# Altium schematic sheet 18.SchDoc
size 513 x 386 mm
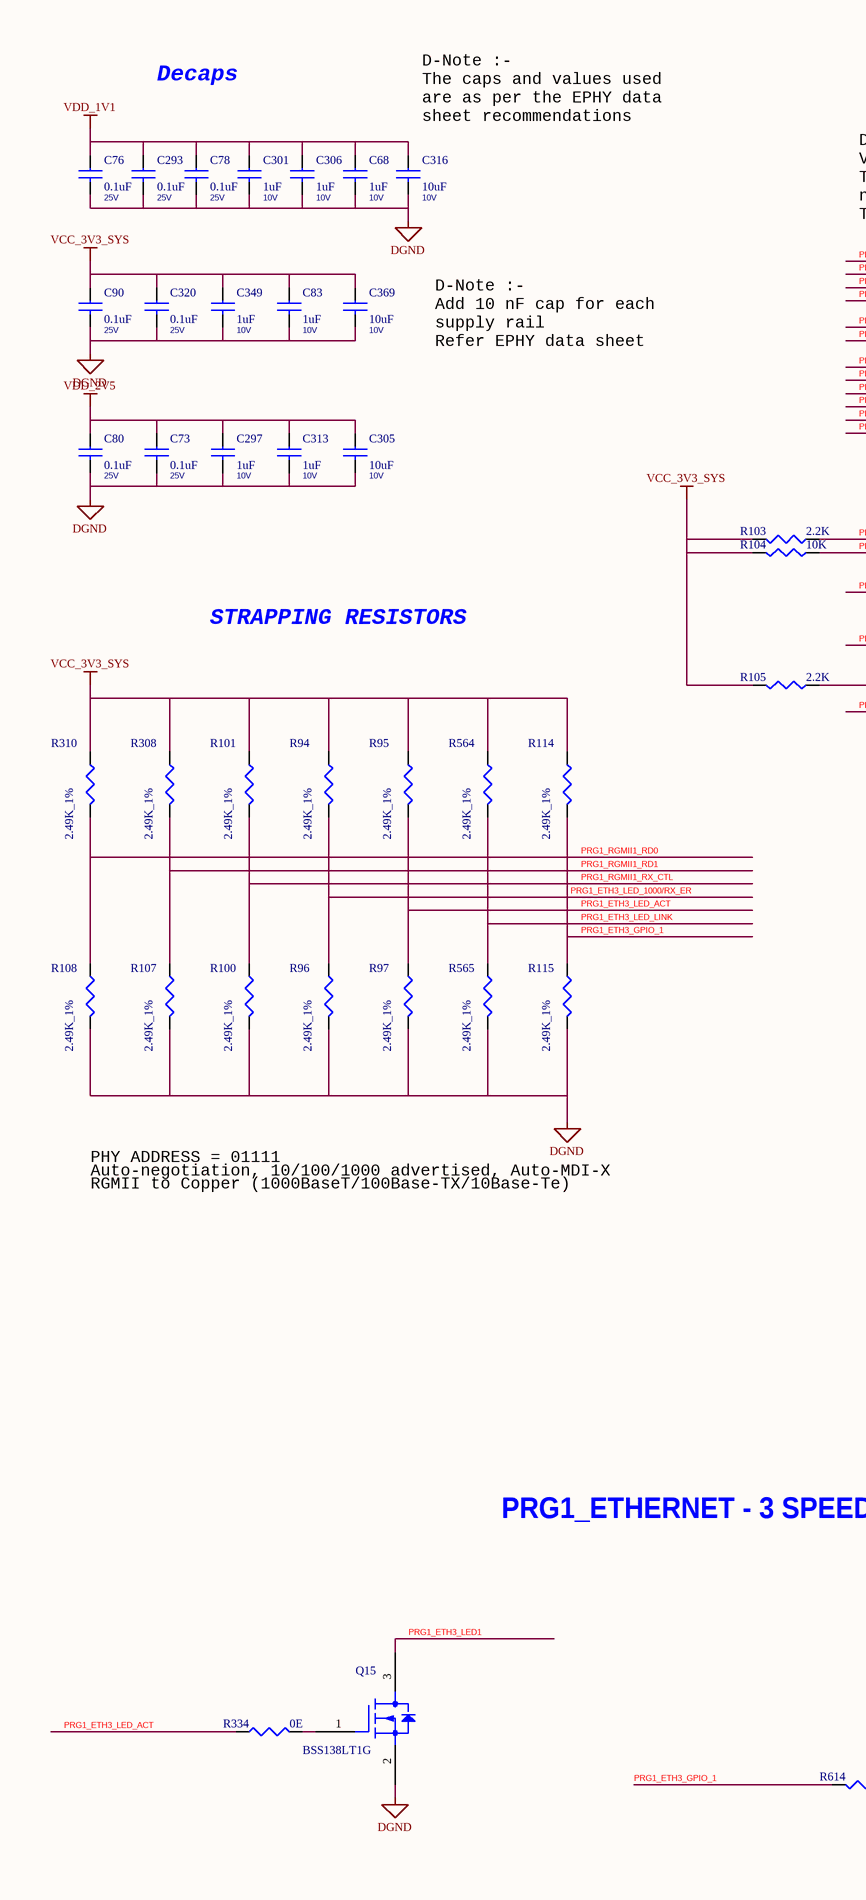
[diagram p0: 18.SchDoc, left]
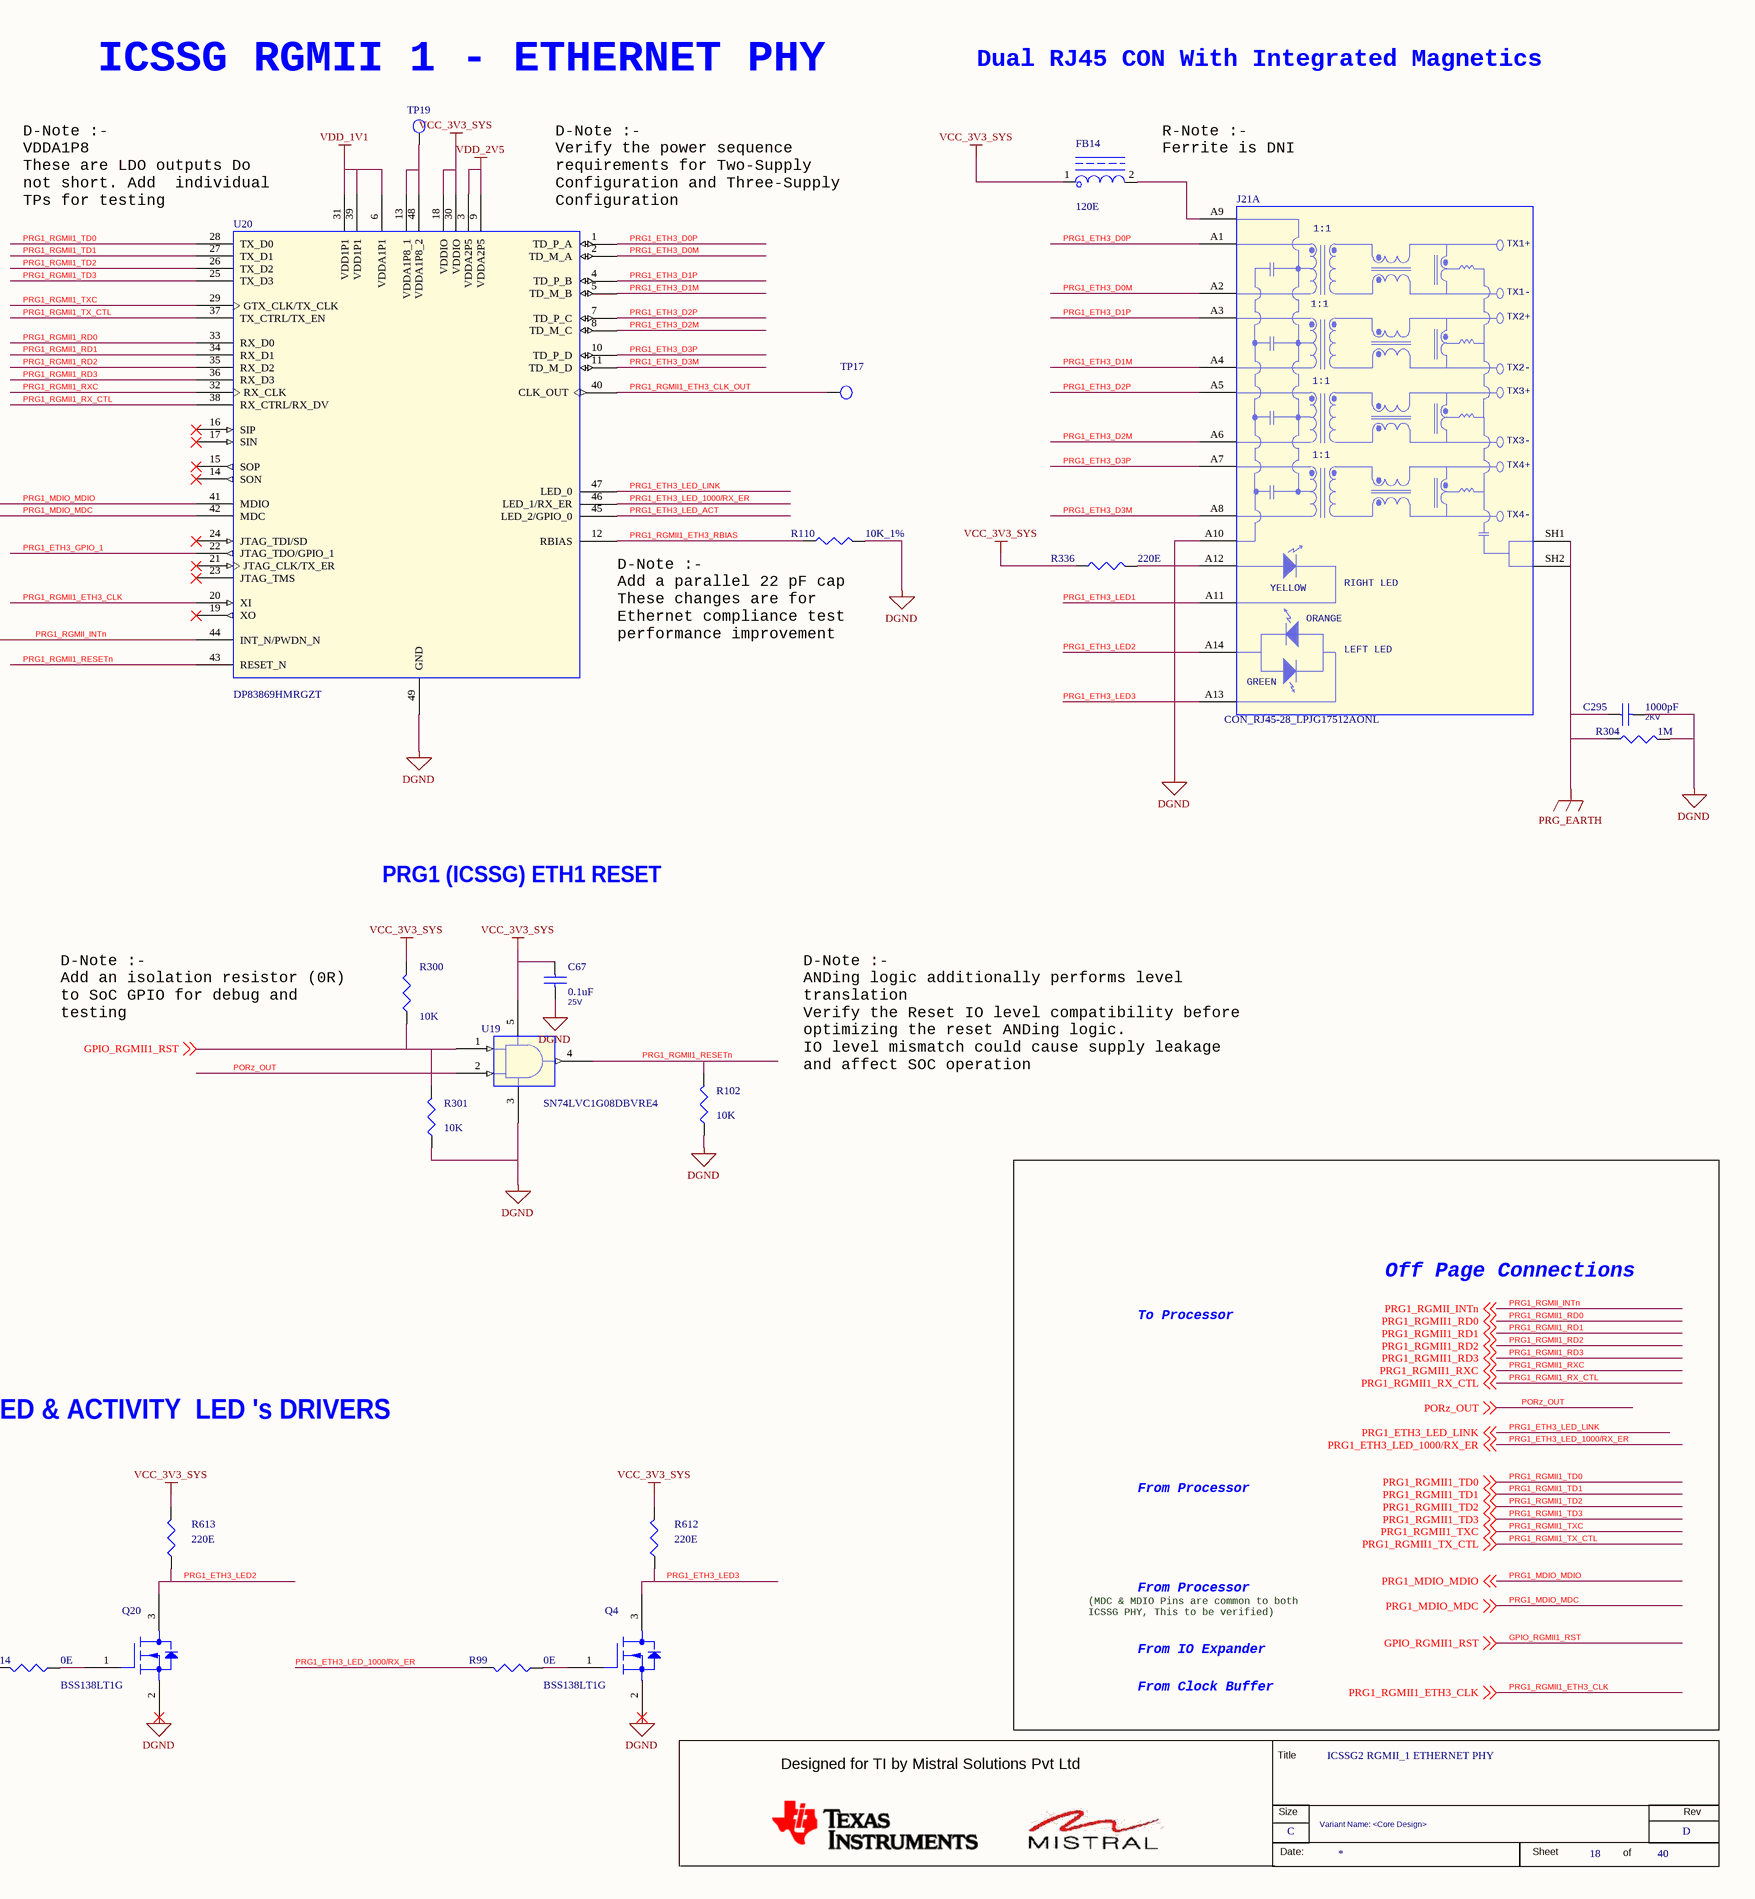
[diagram p1: 18.SchDoc, right]

## Parts
*  RevCode: D  Title: ICSSG2 RGMII_1 ETHERNET PHY  Page Size: C  Page Number: 18  Page Count: 40  Variant Name: <Core Design>  (hidden comment: MISTRAL_TITLEBLK_CSIZE)  (graphical)
C67  0.1uF  Voltage: 25V  [CAP0402_0-75]
C68  1uF  Voltage: 10V  [CAP0402_0-75]
C73  0.1uF  Voltage: 25V  [CAP0402_0-75]
C76  0.1uF  Voltage: 25V  [CAP0402_0-75]
C78  0.1uF  Voltage: 25V  [CAP0402_0-75]
C80  0.1uF  Voltage: 25V  [CAP0402_0-75]
C83  1uF  Voltage: 10V  [CAP0402_0-75]
C90  0.1uF  Voltage: 25V  [CAP0402_0-75]
C293  0.1uF  Voltage: 25V  [CAP0402_0-75]
C295  1000pF  Voltage: 2KV  [CAP1206_1-75]
C297  1uF  Voltage: 10V  [CAP0402_0-75]
C301  1uF  Voltage: 10V  [CAP0402_0-75]
C305  10uF  Voltage: 10V  [CAP0402_0-75]
C306  1uF  Voltage: 10V  [CAP0402_0-75]
C313  1uF  Voltage: 10V  [CAP0402_0-75]
C316  10uF  Voltage: 10V  [CAP0402_0-75]
C320  0.1uF  Voltage: 25V  [CAP0402_0-75]
C349  1uF  Voltage: 10V  [CAP0402_0-75]
C369  10uF  Voltage: 10V  [CAP0402_0-75]
FB14  120E  [IND0603_1]
J21  CON_RJ45-28_LPJG17512AONL  [CON_RJ45-28_LPJG17512_S_R_T_25-3]  (part A of 2)
Q4  BSS138LT1G  [SOT23-123_1-2]
Q15  BSS138LT1G  [SOT23-123_1-2]
Q20  BSS138LT1G  [SOT23-123_1-2]
R94  2.49K_1%  [RES0402_0-5]
R95  2.49K_1%  [RES0402_0-5]
R96  2.49K_1%  [RES0402_0-5]
R97  2.49K_1%  [RES0402_0-5]
R99  0E  [RES0402_0-5]
R100  2.49K_1%  [RES0402_0-5]
R101  2.49K_1%  [RES0402_0-5]
R102  10K  [RES0402_0-5]
R103  2.2K  [RES0402_0-5]
R104  10K  [RES0402_0-5]
R105  2.2K  [RES0402_0-5]
R107  2.49K_1%  [RES0402_0-5]
R108  2.49K_1%  [RES0402_0-5]
R110  10K_1%  [RES0402_0-5]
R114  2.49K_1%  [RES0402_0-5]
R115  2.49K_1%  [RES0402_0-5]
R300  10K  [RES0402_0-5]
R301  10K  [RES0402_0-5]
R304  1M  [RES0603_0-75]
R308  2.49K_1%  [RES0402_0-5]
R310  2.49K_1%  [RES0402_0-5]
R334  0E  [RES0402_0-5]
R336  220E  [RES0402_0-5]
R564  2.49K_1%  [RES0402_0-5]
R565  2.49K_1%  [RES0402_0-5]
R612  220E  [RES0402_0-5]
R613  220E  [RES0402_0-5]
R614  0E  [RES0402_0-5]
TP17  TP20_SMD  [TP20_SMD]  (value not drawn)
TP19  TP20_SMD  [TP20_SMD]  (value not drawn)
U19  SN74LVC1G08DBVRE4  [SOT23-5]
U20  DP83869HMRGZT  [QFN48_19-68_280X280_1_EP4-2]

## Nets
DGND: C67.2 C68.2 C73.2 C76.2 C78.2 C80.2 C83.2 C90.2 C293.2 C295.2 C297.2 C301.2 C305.2 C306.2 C313.2 C316.2 C320.2 C349.2 C369.2 J21.A10(GND) Q4.2(S) Q15.2(S) Q20.2(S) R96.2 R97.2 R100.2 R102.2 R107.2 R108.2 R110.1 R115.2 R301.2 R304.2 R565.2 U19.3(GND) U20.49(GND)
PRG_EARTH: C295.1 J21.SH1 J21.SH2 R304.1
VCC_3V3_SYS: C67.1 C83.1 C90.1 C320.1 C349.1 C369.1 FB14.1 R94.1 R95.1 R101.1 R103.2 R104.1 R105.2 R114.1 R300.2 R308.1 R310.1 R336.1 R564.1 R612.2 R613.2 U19.5(VCC) U20.18(VDDIO) U20.30(VDDIO)
VDD_1V1: C68.1 C76.1 C78.1 C293.1 C301.1 C306.1 C316.1 U20.6(VDDA1P1) U20.31(VDD1P1) U20.39(VDD1P1)
VDD_2V5: C73.1 C80.1 C297.1 C305.1 C313.1 U20.3(VDDA2P5) U20.9(VDDA2P5)
GPIO_RGMII1_RST: R300.1 R301.1 U19.1(A) ; off-sheet GPIO_RGMII1_RST
PORz_OUT: U19.2(B) ; off-sheet PORz_OUT
PRG1_ETH3_D0M: J21.A2(TD1-_1) U20.2(TD_M_A)
PRG1_ETH3_D0P: J21.A1(TD1+_1) U20.1(TD_P_A)
PRG1_ETH3_D1M: J21.A4(TD2-_1) U20.5(TD_M_B)
PRG1_ETH3_D1P: J21.A3(TD2+_1) U20.4(TD_P_B)
PRG1_ETH3_D2M: J21.A6(TD3-_1) U20.8(TD_M_C)
PRG1_ETH3_D2P: J21.A5(TD3+_1) U20.7(TD_P_C)
PRG1_ETH3_D3M: J21.A8(TD4-_1) U20.11(TD_M_D)
PRG1_ETH3_D3P: J21.A7(TD4+_1) U20.10(TD_P_D)
PRG1_ETH3_GPIO_1: R114.2 R115.1 R614.2 U20.22(JTAG_TDO/GPIO_1)
PRG1_ETH3_LED1: J21.A11 Q15.3(D)
PRG1_ETH3_LED2: J21.A14 Q20.3(D) R613.1
PRG1_ETH3_LED3: J21.A13 Q4.3(D) R612.1
PRG1_ETH3_LED_1000/RX_ER: R94.2 R96.1 R99.2 U20.46(LED_1/RX_ER) ; off-sheet PRG1_ETH3_LED_1000/RX_ER
PRG1_ETH3_LED_ACT: R95.2 R97.1 R334.1 U20.45(LED_2/GPIO_0)
PRG1_ETH3_LED_LINK: R564.2 R565.1 U20.47(LED_0) ; off-sheet PRG1_ETH3_LED_LINK
PRG1_MDIO_MDC: R104.2 U20.42(MDC) ; off-sheet PRG1_MDIO_MDC
PRG1_MDIO_MDIO: R103.1 U20.41(MDIO) ; off-sheet PRG1_MDIO_MDIO
PRG1_RGMII1_ETH3_CLK: U20.20(XI) ; off-sheet PRG1_RGMII1_ETH3_CLK
PRG1_RGMII1_ETH3_CLK_OUT: TP17.1(TP) U20.40(CLK_OUT)
PRG1_RGMII1_ETH3_RBIAS: R110.2 U20.12(RBIAS)
PRG1_RGMII1_RD0: R108.1 R310.2 U20.33(RX_D0) ; off-sheet PRG1_RGMII1_RD0
PRG1_RGMII1_RD1: R107.1 R308.2 U20.34(RX_D1) ; off-sheet PRG1_RGMII1_RD1
PRG1_RGMII1_RD2: U20.35(RX_D2) ; off-sheet PRG1_RGMII1_RD2
PRG1_RGMII1_RD3: U20.36(RX_D3) ; off-sheet PRG1_RGMII1_RD3
PRG1_RGMII1_RESETn: R102.1 U19.4(Y) U20.43(RESET_N)
PRG1_RGMII1_RX_CTL: R100.1 R101.2 U20.38(RX_CTRL/RX_DV) ; off-sheet PRG1_RGMII1_RX_CTL
PRG1_RGMII1_RXC: U20.32(RX_CLK) ; off-sheet PRG1_RGMII1_RXC
PRG1_RGMII1_TD0: U20.28(TX_D0) ; off-sheet PRG1_RGMII1_TD0
PRG1_RGMII1_TD1: U20.27(TX_D1) ; off-sheet PRG1_RGMII1_TD1
PRG1_RGMII1_TD2: U20.26(TX_D2) ; off-sheet PRG1_RGMII1_TD2
PRG1_RGMII1_TD3: U20.25(TX_D3) ; off-sheet PRG1_RGMII1_TD3
PRG1_RGMII1_TX_CTL: U20.37(TX_CTRL/TX_EN) ; off-sheet PRG1_RGMII1_TX_CTL
PRG1_RGMII1_TXC: U20.29(GTX_CLK/TX_CLK) ; off-sheet PRG1_RGMII1_TXC
PRG1_RGMII_INTn: R105.1 U20.44(INT_N/PWDN_N) ; off-sheet PRG1_RGMII_INTn
NetFB14_2: FB14.2 J21.A9(VCC)
NetJ21_A12: J21.A12 R336.2
NetQ4_1: Q4.1(G) R99.1
NetQ15_1: Q15.1(G) R334.2
NetQ20_1: Q20.1(G) R614.1
NetTP19_1: TP19.1(TP) U20.13(VDDA1P8_1) U20.48(VDDA1P8_2)

Not connected (* = marked no-connect by the designer): U20 14(SON)* 15(SOP)* 16(SIP)* 17(SIN)* 19(XO)* 21(JTAG_CLK/TX_ER)* 23(JTAG_TMS)* 24(JTAG_TDI/SD)*

## Notes on the sheet
- (near C316) D-Note :-
  The caps and values used
  are as per the EPHY data
  sheet recommendations
- Decaps
- ICSSG RGMII 1 - ETHERNET PHY
- Dual RJ45 CON With Integrated Magnetics
- (near U20) D-Note :-
  VDDA1P8
  These are LDO outputs Do
  not short. Add  individual
  TPs for testing
- (near U20) D-Note :-
  Verify the power sequence
  requirements for Two-Supply
  Configuration and Three-Supply
  Configuration
- R-Note :-
  Ferrite is DNI
- D-Note :-
  Add 10 nF cap for each
  supply rail
  Refer EPHY data sheet
- STRAPPING RESISTORS
- (near R110) D-Note :-
  Add a parallel 22 pF cap
  These changes are for
  Ethernet compliance test
  performance improvement
- PRG1 (ICSSG) ETH1 RESET
- (near R300) D-Note :-
  Add an isolation resistor (0R)
  to SoC GPIO for debug and
  testing
- D-Note :-
  ANDing logic additionally performs level
  translation
  Verify the Reset IO level compatibility before
  optimizing the reset ANDing logic.
  IO level mismatch could cause supply leakage
  and affect SOC operation
- PHY ADDRESS = 01111
- Auto-negotiation, 10/100/1000 advertised, Auto-MDI-X
- RGMII to Copper (1000BaseT/100Base-TX/10Base-Te)
- Off Page Connections
- To Processor
- PRG1_ETHERNET - 3 SPEED & ACTIVITY  LED 's DRIVERS
- From Processor
- (MDC & MDIO Pins are common to both
  ICSSG PHY, This to be verified)
- From IO Expander
- From Clock Buffer
- (in symbol CON_RJ45-28_LPJG17512AONL, part A) 1:1; TX1+; TX1-; TX2+; TX2-; TX3+; TX3-; TX4+; TX4-; RIGHT LED; YELLOW; ORANGE; LEFT LED; GREEN
- (in symbol MISTRAL_TITLEBLK_CSIZE) Title; Designed for TI by Mistral Solutions Pvt Ltd; Size; Rev; Date:; Sheet; of

## Library data of the parts
* = MISTRAL_TITLEBLK_CSIZE: Issue: 1.0; Page Create Date: March  8, 1995; Page Modify Date: *
C67 C73 C76 C78 C80 C90 C293 C320 = CAP_Dup3: CAP CERAMIC 0.1uF 25V 20% X5R 0402; Alt_Mfr_name: YAGEO AMERICA; Part_type: CAPACITORS\CERAMIC; Mfr_part_number: 885012105018; Mfr_name: WURTH ELECTRONICS; Mistral Part No: 120020080003-R; Alt_Mfr_part_number: CC0402KRX5R8BB104; Custom_Duty: 15%; Customs_HS_Code: 85322990; Wattage: NA; Project: AM64x_EVM_BRD; Footprint Path: Y:\MIS_DATABASE\Library\ALTIUM_TOOL\PCB_FOOTPRINTS\Altium_Footprint_Lib.PcbLib; Library Path: Y:\MIS_DATABASE\Library\ALTIUM_TOOL\SCHEMATICS_PARTS\MS_DISCRETE_Library.schlib; Footprint Ref: CAP0402_0-75; Library Ref: CAP; MECHANICAL 3D STEP FILE: CAP0402_0-75; Chkd/date: MANIRAJA/170820; Crtd /date: ALVY/170820; Datasheet: Y:\MIS_DATABASE\DATASHEETS\CAPACITORS\885012105018.PDF; Temperature: -55癈+85癈; Weight: 0.65mg; Height: 0.55MM; Distributor_part_number: 732-7495-1-ND; Distributor_name: DIGIKEY; Package: 0402; Tolerance: 20%; PCB Footprint: CAP0402_0-75
C68 C297 C301 C313 C349 = CAP_Dup3: CAP CERAMIC 1uF 10V 20% X5R 0402; Part_type: CAPACITORS\CERAMIC; Mfr_part_number: 885012105012; Mfr_name: WURTH ELECTRONICS; Mistral Part No: 120020080009-R; Custom_Duty: 15%; Customs_HS_Code: 85322990; Wattage: NA; Project: AM64x_EVM_BRD; Footprint Ref: CAP0402_0-75; Library Ref: CAP; Chkd/date: MANIRAJA/210820; Crtd /date: ALVY/190820; Datasheet: Y:\MIS_DATABASE\DATASHEETS\CAPACITORS\885012105012.PDF; Temperature: -55癈+85癈; Weight: 0.65mg; Height: 0.55MM; Distributor_part_number: 732-7489-1-ND; Distributor_name: DIGIKEY; Package: 0402; Tolerance: 20%; MECHANICAL 3D STEP FILE: CAP0402_0-75; Library Path: Y:\MIS_DATABASE\Library\ALTIUM_TOOL\SCHEMATICS_PARTS\MS_DISCRETE_Library.schlib; Footprint Path: Y:\MIS_DATABASE\Library\ALTIUM_TOOL\PCB_FOOTPRINTS\Altium_Footprint_Lib.PcbLib; PCB Footprint: CAP0402_0-75
C83 C306 = CAP_Dup3: CAP CERAMIC 1uF 10V 20% X5R 0402; Mistral Part No: 120020080009-R; Mfr_name: WURTH ELECTRONICS; Mfr_part_number: 885012105012; Part_type: CAPACITORS\CERAMIC; Project: AM64x_EVM_BRD; Wattage: NA; Customs_HS_Code: 85322990; Custom_Duty: 15%; Footprint Path: Y:\MIS_DATABASE\Library\ALTIUM_TOOL\PCB_FOOTPRINTS\Altium_Footprint_Lib.PcbLib; Library Path: Y:\MIS_DATABASE\Library\ALTIUM_TOOL\SCHEMATICS_PARTS\MS_DISCRETE_Library.schlib; MECHANICAL 3D STEP FILE: CAP0402_0-75; Tolerance: 20%; Package: 0402; Distributor_name: DIGIKEY; Distributor_part_number: 732-7489-1-ND; Height: 0.55MM; Weight: 0.65mg; Temperature: -55癈+85癈; Datasheet: Y:\MIS_DATABASE\DATASHEETS\CAPACITORS\885012105012.PDF; Crtd /date: ALVY/190820; Chkd/date: MANIRAJA/210820; Library Ref: CAP; Footprint Ref: CAP0402_0-75; PCB Footprint: CAP0402_0-75
C295 = CAP_Dup3: CAP CERAMIC 1000pF 2KV 10% X7R 1206; Mistral Part No: 120015080006-R; Mfr_name: AVX CORPORATION; Mfr_part_number: 1206GC102KAT1A; Part_type: CAPACITORS\CERAMIC; Project: ADR1B; Customs_HS_Code: 85322990; Custom_Duty: 15%; Wattage: NA; Tolerance: 10%; Package: 1206; Distributor_name: DIGIKEY; Distributor_part_number: 478-2956-1-ND; Height: 1.52MM; Weight: 16.2mg; Temperature: -55癈+125癈; Datasheet: Y:\MIS_DATABASE\DATASHEETS\CAPACITORS\AVX_HV-MLC.PDF; Crtd /date: MAZHAR/281106; Chkd/date: SHREESHAIL/291106; Library Ref: CAP; Footprint Ref: CAP1206_1-75; Library Path: Y:\MIS_DATABASE\Library\ALTIUM_TOOL\SCHEMATICS_PARTS\MS_DISCRETE_Library.schlib; Footprint Path: Y:\MIS_DATABASE\Library\ALTIUM_TOOL\PCB_FOOTPRINTS\Altium_Footprint_Lib.PcbLib; MECHANICAL 3D STEP FILE: CAP1206_1-75; PCB Footprint: CAP1206_1-75
C305 = CAP_Dup3: CAP CERAMIC 10uF 10V 20% X5R 0402; Part_type: CAPACITORS\CERAMIC; Mfr_part_number: GRM155R61A106ME11D; Mfr_name: MURATA; Mistral Part No: 120013110019-R; Custom_Duty: 15%; Customs_HS_Code: 85322990; Project: QCS610_NANOSOM; Wattage: NA; Footprint Path: Y:\MIS_DATABASE\Library\ALTIUM_TOOL\PCB_FOOTPRINTS\Altium_Footprint_Lib.PcbLib; Library Path: Y:\MIS_DATABASE\Library\ALTIUM_TOOL\SCHEMATICS_PARTS\MS_DISCRETE_Library.schlib; Footprint Ref: CAP0402_0-75; Chkd/date: MANIRAJA/300520; Crtd /date: ALVY/260520; Datasheet: Y:\MIS_DATABASE\DATASHEETS\CAPACITORS\MURATA-GXX-SER_NOV17.PDF; Height: 0.55MM; Distributor_part_number: 490-GRM155R61A106ME11DTR-ND; Distributor_name: DIGIKEY; Package: 0402; Tolerance: 20%; Weight: 3.1mg; Temperature: -55癈+85癈; MECHANICAL 3D STEP FILE: CAP0402_0-75; Library Ref: CAP; PCB Footprint: CAP0402_0-75
C316 = CAP_Dup3: CAP CERAMIC 10uF 10V 20% X5R 0402; Mistral Part No: 120013110019-R; Mfr_name: MURATA; Mfr_part_number: GRM155R61A106ME11D; Part_type: CAPACITORS\CERAMIC; Wattage: NA; Project: QCS610_NANOSOM; Customs_HS_Code: 85322990; Custom_Duty: 15%; Footprint Path: Y:\MIS_DATABASE\Library\ALTIUM_TOOL\PCB_FOOTPRINTS\Altium_Footprint_Lib.PcbLib; Library Path: Y:\MIS_DATABASE\Library\ALTIUM_TOOL\SCHEMATICS_PARTS\MS_DISCRETE_Library.schlib; Footprint Ref: CAP0402_0-75; Library Ref: CAP; MECHANICAL 3D STEP FILE: CAP0402_0-75; Temperature: -55癈+85癈; Weight: 3.1mg; Tolerance: 20%; Package: 0402; Distributor_name: DIGIKEY; Distributor_part_number: 490-GRM155R61A106ME11DTR-ND; Height: 0.55MM; Datasheet: Y:\MIS_DATABASE\DATASHEETS\CAPACITORS\MURATA-GXX-SER_NOV17.PDF; Crtd /date: ALVY/260520; Chkd/date: MANIRAJA/300520; PCB Footprint: CAP0402_0-75
C369 = CAP_Dup3: CAP CERAMIC 10uF 10V 20% X5R 0402; Part_type: CAPACITORS\CERAMIC; Mfr_part_number: GRM155R61A106ME11D; Mfr_name: MURATA; Mistral Part No: 120013110019-R; Wattage: NA; Custom_Duty: 15%; Customs_HS_Code: 85322990; Project: QCS610_NANOSOM; Footprint Path: Y:\MIS_DATABASE\Library\ALTIUM_TOOL\PCB_FOOTPRINTS\Altium_Footprint_Lib.PcbLib; Library Path: Y:\MIS_DATABASE\Library\ALTIUM_TOOL\SCHEMATICS_PARTS\MS_DISCRETE_Library.schlib; Footprint Ref: CAP0402_0-75; Library Ref: CAP; MECHANICAL 3D STEP FILE: CAP0402_0-75; Temperature: -55癈+85癈; Weight: 3.1mg; Chkd/date: MANIRAJA/300520; Crtd /date: ALVY/260520; Datasheet: Y:\MIS_DATABASE\DATASHEETS\CAPACITORS\MURATA-GXX-SER_NOV17.PDF; Height: 0.55MM; Distributor_part_number: 490-GRM155R61A106ME11DTR-ND; Distributor_name: DIGIKEY; Package: 0402; Tolerance: 20%; PCB Footprint: CAP0402_0-75
FB14 = INDUCTOR_FERRITE: IND FERRITE BEAD CHIP 120E 2A 0603; Mistral Part No: 130020080015-R; Mfr_name: WURTH ELECTRONICS; Mfr_part_number: 782631141; Project: AM64x_EVM_BRD; Tolerance: 25%; Voltage: NA; Customs_HS_Code: 85437099; Custom_Duty: 24%; PCB Footprint: IND0603_1; Footprint Ref: IND0603_1; Part_type: INDUCTOR; Wattage: NA; Package: 0603; Distributor_name: DIGIKEY; Distributor_part_number: 732-782631141CT-ND; Library Ref: INDUCTOR_FERRITE; Height: 1.00MM; Weight: NA; Temperature: -55癈+125癈; Datasheet: Y:\MIS_DATABASE\DATASHEETS\DISCRETES\INDUCTORS\782631141.PDF; Crtd /date: ALVY/180820; Chkd/date: MANIRAJA/180820; MECHANICAL 3D STEP FILE: IND0603_1; Library Path: Y:\MIS_DATABASE\Library\ALTIUM_TOOL\SCHEMATICS_PARTS\MS_FILTER_Library.schlib; Footprint Path: Y:\MIS_DATABASE\Library\ALTIUM_TOOL\PCB_FOOTPRINTS\Altium_Footprint_Lib.PcbLib
J21 = CON_RJ45-28_LPJG17512AONL: CON JACK RJ45 28POS REGISTERED FEMALE RA TH; Mistral Part No: 150017080001-R; Mfr_name: LINK-PP; Part_type: CONNECTOR\JACK; Project: TI_SVB_DUT; Tolerance: NA; Customs_HS_Code: 85369090; Custom_Duty: 24%; Mfr_part_number: LPJG17512AONL; Voltage: NA; Wattage: NA; Package: THRU-HOLE; Distributor_name: NA; Distributor_part_number: NA; Height: 25.30MM; Weight: NA; Temperature: 0癈+70癈; Datasheet: Y:\MIS_DATABASE\DATASHEETS\CONNECTORS\LPJG17512AONL.PDF; Crtd /date: MANIRAJA/010817; Chkd/date: MANIRAJA/010817; MECHANICAL 3D STEP FILE: CON_RJ45-28_LPJG17512_S_R_T_25-3; Library Ref: CON_RJ45-28_LPJG17512AONL; PCB Footprint: CON_RJ45-28_LPJG17512_S_R_T_25-3
Q4 Q15 Q20 = MOSFET_BSS138LT1G: IC MOSFET N-CHANNEL 50V 200mA SOT23-3; Mistral Part No: 142016040001-R; Mfr_name: ON SEMICONDUCTOR; Part_type: ICS\POWER\MOSFET; Project: LRDE_ABCM; Tolerance: NA; Customs_HS_Code: 85423100; Custom_Duty: 15%; Footprint Path: Y:\MIS_DATABASE\Library\ALTIUM_TOOL\PCB_FOOTPRINTS\Altium_Footprint_Lib.PcbLib; Library Path: Y:\MIS_DATABASE\Library\ALTIUM_TOOL\SCHEMATICS_PARTS\MS_MOSFET_Library.schlib; MECHANICAL 3D STEP FILE: SOT23-123_1-2; Footprint Ref: SOT23-123_1-2; Mfr_part_number: BSS138LT1G; Voltage: NA; Wattage: NA; Package: SOT23-3; Distributor_name: DIGIKEY; Distributor_part_number: BSS138LT1GOSCT-ND; Height: 1.11MM; Weight: 8mg; Temperature: -55癈+150癈; Datasheet: Y:\MIS_DATABASE\DATASHEETS\DISCRETES\TRANSISTORS_FETS\BSS138LT1G.PDF; Crtd /date: JEBRAN/060416; Chkd/date: MANIRAJA/250219; Library Ref: MOSFET_BSS138W; PCB Footprint: SOT23-123_1-2
R94 R97 R115 R308 R310 R564 R565 = RESISTOR_Dup6: RES 2.49K 1/16W 1% 0402; Mistral Part No: 110016050020-R; Mfr_name: YAGEO AMERICA; Mfr_part_number: RC0402FR-072K49L; Part_type: RESISTORS\FIXED; Project: TMDXCSKCC; Voltage: NA; Customs_HS_Code: 85332119; Custom_Duty: 15%; Tolerance: 1%; Wattage: 1/16W; Package: 0402; Distributor_name: DIGIKEY; Distributor_part_number: 311-2.49KLRCT-ND; Height: 0.40MM; Weight: 0.65mg; Temperature: -55癈+155癈; Datasheet: Y:\MIS_DATABASE\DATASHEETS\RESISTORS\RCXXXXL-SER_MAR18.PDF; Crtd /date: VASANTHA/270516; Chkd/date: VASANTHA/270516; Library Ref: RESISTOR; Footprint Ref: RES0402_0-5; MECHANICAL 3D STEP FILE: RES0402_0-5; Library Path: Y:\MIS_DATABASE\Library\ALTIUM_TOOL\SCHEMATICS_PARTS\MS_DISCRETE_Library.schlib; Footprint Path: Y:\MIS_DATABASE\Library\ALTIUM_TOOL\PCB_FOOTPRINTS\Altium_Footprint_Lib.PcbLib; PCB Footprint: RES0402_0-5
R95 R96 R100 R101 R107 R108 R114 = RESISTOR_Dup6: RES 2.49K 1/16W 1% 0402; Part_type: RESISTORS\FIXED; Mfr_part_number: RC0402FR-072K49L; Mfr_name: YAGEO AMERICA; Mistral Part No: 110016050020-R; Custom_Duty: 15%; Customs_HS_Code: 85332119; Voltage: NA; Project: TMDXCSKCC; Library Ref: RESISTOR; Chkd/date: VASANTHA/270516; Crtd /date: VASANTHA/270516; Datasheet: Y:\MIS_DATABASE\DATASHEETS\RESISTORS\RCXXXXL-SER_MAR18.PDF; Temperature: -55癈+155癈; Weight: 0.65mg; Height: 0.40MM; Distributor_part_number: 311-2.49KLRCT-ND; Distributor_name: DIGIKEY; Package: 0402; Wattage: 1/16W; Tolerance: 1%; Footprint Ref: RES0402_0-5; MECHANICAL 3D STEP FILE: RES0402_0-5; Library Path: Y:\MIS_DATABASE\Library\ALTIUM_TOOL\SCHEMATICS_PARTS\MS_DISCRETE_Library.schlib; Footprint Path: Y:\MIS_DATABASE\Library\ALTIUM_TOOL\PCB_FOOTPRINTS\Altium_Footprint_Lib.PcbLib; PCB Footprint: RES0402_0-5
R99 R614 = RESISTOR_Dup5: RES 0E 1/16W JUMPER 0402; Mistral Part No: 110010080019-R; Mfr_name: VISHAY; Mfr_part_number: CRCW04020000Z0ED; Part_type: RESISTORS\FIXED; Project: PB_BUGBASE; Tolerance: NA; Customs_HS_Code: 85332119; Custom_Duty: 15%; Voltage: NA; Wattage: 1/16W; Package: 0402; Distributor_name: DIGIKEY; Distributor_part_number: 541-0.0JCT-ND; Height: 0.40MM; Weight: 0.65mg; Temperature: -55癈+155癈; Datasheet: Y:\MIS_DATABASE\DATASHEETS\RESISTORS\CRCW0603.PDF; Crtd /date: MUDDU/190810; Chkd/date: VASANTHA/201216; MECHANICAL 3D STEP FILE: RES0402_0-5; Library Ref: RESISTOR; Footprint Ref: RES0402_0-5; Library Path: Y:\MIS_DATABASE\Library\ALTIUM_TOOL\SCHEMATICS_PARTS\MS_DISCRETE_Library.schlib; Footprint Path: Y:\MIS_DATABASE\Library\ALTIUM_TOOL\PCB_FOOTPRINTS\Altium_Footprint_Lib.PcbLib; PCB Footprint: RES0402_0-5
R102 R104 R300 = RESISTOR_Dup6: RES 10K 1/16W 5% 0402; Mistral Part No: 110011060021-R; Mfr_name: YAGEO AMERICA; Mfr_part_number: RC0402JR-0710KL; Part_type: RESISTORS\FIXED; Project: HSE; Voltage: NA; Customs_HS_Code: 85332119; Custom_Duty: 15%; Tolerance: 5%; Wattage: 1/16W; Package: 0402; Distributor_name: DIGIKEY; Distributor_part_number: 311-10KJRCT-ND; Height: 0.40MM; Weight: 0.65mg; Temperature: -55癈+155癈; Datasheet: Y:\MIS_DATABASE\DATASHEETS\RESISTORS\RCXXXXL-SER_MAR18.PDF; Crtd /date: MAZHAR/230805; Chkd/date: VASANTHA/061216; MECHANICAL 3D STEP FILE: RES0402_0-5; Library Ref: RESISTOR; Footprint Ref: RES0402_0-5; Library Path: Y:\MIS_DATABASE\Library\ALTIUM_TOOL\SCHEMATICS_PARTS\MS_DISCRETE_Library.schlib; Footprint Path: Y:\MIS_DATABASE\Library\ALTIUM_TOOL\PCB_FOOTPRINTS\Altium_Footprint_Lib.PcbLib; PCB Footprint: RES0402_0-5
R103 R105 = RESISTOR_Dup6: RES 2.2K 1/16W 5% 0402; Mistral Part No: 110010120018-R; Mfr_name: YAGEO AMERICA; Mfr_part_number: RC0402JR-072K2L; Part_type: RESISTORS\FIXED; Project: TE4; Voltage: NA; Customs_HS_Code: 85332119; Custom_Duty: 15%; Tolerance: 5%; Wattage: 1/16W; Package: 0402; Distributor_name: DIGIKEY; Distributor_part_number: 311-2.2KJRCT-ND; Height: 0.40MM; Weight: 0.65mg; Temperature: -55癈+155癈; Datasheet: Y:\MIS_DATABASE\DATASHEETS\RESISTORS\RCXXXXL-SER_MAR18.PDF; Crtd /date: BAVISH/021210; Chkd/date: VASANTHA/061216; MECHANICAL 3D STEP FILE: RES0402_0-5; Footprint Path: Y:\MIS_DATABASE\Library\ALTIUM_TOOL\PCB_FOOTPRINTS\Altium_Footprint_Lib.PcbLib; Library Ref: RESISTOR; Footprint Ref: RES0402_0-5; Library Path: Y:\MIS_DATABASE\Library\ALTIUM_TOOL\SCHEMATICS_PARTS\MS_DISCRETE_Library.schlib; PCB Footprint: RES0402_0-5
R110 = RESISTOR_Dup6: RES 10K 1/10W 1% AUTO 0402; Part_type: RESISTORS\FIXED; Mfr_part_number: MCS0402MC1002FE000; Mfr_name: VISHAY; Mistral Part No: 110020100039-R; Custom_Duty: 15%; Customs_HS_Code: 85332119; Voltage: NA; Project: MCX_80MHz_ADC_DRIVER; Library Ref: RESISTOR; MECHANICAL 3D STEP FILE: RES0402_0-5; Chkd/date: MANIRAJA/191020; Crtd /date: ALVY/191020; Datasheet: Y:\MIS_DATABASE\DATASHEETS\RESISTORS\MCTXXXXM-SER.PDF; Temperature: -55癈+175癈; Weight: 0.65mg; Height: 0.37MM; Distributor_part_number: MCS0402-10.0K-MFCT-ND; Distributor_name: DIGIKEY; Package: 0402; Wattage: 1/10W; Tolerance: 1%; Footprint Ref: RES0402_0-5; Library Path: Y:\MIS_DATABASE\Library\ALTIUM_TOOL\SCHEMATICS_PARTS\MS_DISCRETE_Library.schlib; Footprint Path: Y:\MIS_DATABASE\Library\ALTIUM_TOOL\PCB_FOOTPRINTS\Altium_Footprint_Lib.PcbLib; PCB Footprint: RES0402_0-5
R301 = RESISTOR_Dup6: RES 10K 1/16W 5% 0402; Part_type: RESISTORS\FIXED; Mfr_part_number: RC0402JR-0710KL; Mfr_name: YAGEO AMERICA; Mistral Part No: 110011060021-R; Custom_Duty: 15%; Customs_HS_Code: 85332119; Voltage: NA; Project: HSE; Footprint Path: Y:\MIS_DATABASE\Library\ALTIUM_TOOL\PCB_FOOTPRINTS\Altium_Footprint_Lib.PcbLib; Library Path: Y:\MIS_DATABASE\Library\ALTIUM_TOOL\SCHEMATICS_PARTS\MS_DISCRETE_Library.schlib; Footprint Ref: RES0402_0-5; Library Ref: RESISTOR; MECHANICAL 3D STEP FILE: RES0402_0-5; Chkd/date: VASANTHA/061216; Crtd /date: MAZHAR/230805; Datasheet: Y:\MIS_DATABASE\DATASHEETS\RESISTORS\RCXXXXL-SER_MAR18.PDF; Temperature: -55癈+155癈; Weight: 0.65mg; Height: 0.40MM; Distributor_part_number: 311-10KJRCT-ND; Distributor_name: DIGIKEY; Package: 0402; Wattage: 1/16W; Tolerance: 5%; PCB Footprint: RES0402_0-5
R304 = RESISTOR_Dup6: RES 1M 1/10W 5% 0603; Mistral Part No: 110009030413-R; Mfr_name: PANASONIC-ECG; Mfr_part_number: ERJ-3GEYJ105V; Part_type: RESISTORS\FIXED; Project: BSN; Voltage: NA; Customs_HS_Code: 85332119; Custom_Duty: 15%; Footprint Path: Y:\MIS_DATABASE\Library\ALTIUM_TOOL\PCB_FOOTPRINTS\Altium_Footprint_Lib.PcbLib; Library Path: Y:\MIS_DATABASE\Library\ALTIUM_TOOL\SCHEMATICS_PARTS\MS_DISCRETE_Library.schlib; Footprint Ref: RES0603_0-75; Library Ref: RESISTOR; Tolerance: 5%; Wattage: 1/10W; Package: 0603; Distributor_name: DIGIKEY; Distributor_part_number: P1.0MGCT-ND; Height: 0.55MM; Weight: 2mg; Temperature: -55癈+155癈; Datasheet: Y:\MIS_DATABASE\DATASHEETS\RESISTORS\PAN-ERJSER_NOV17.PDF; Crtd /date: USMAN/111207; Chkd/date: VASANTHA/060217; MECHANICAL 3D STEP FILE: RES0603_0-75; PCB Footprint: RES0603_0-75
R334 = RESISTOR_Dup5: RES 0E 1/16W JUMPER 0402; Part_type: RESISTORS\FIXED; Mfr_part_number: CRCW04020000Z0ED; Mfr_name: VISHAY; Mistral Part No: 110010080019-R; Custom_Duty: 15%; Customs_HS_Code: 85332119; Voltage: NA; Project: PB_BUGBASE; Footprint Path: Y:\MIS_DATABASE\Library\ALTIUM_TOOL\PCB_FOOTPRINTS\Altium_Footprint_Lib.PcbLib; Library Path: Y:\MIS_DATABASE\Library\ALTIUM_TOOL\SCHEMATICS_PARTS\MS_DISCRETE_Library.schlib; Footprint Ref: RES0402_0-5; Library Ref: RESISTOR; MECHANICAL 3D STEP FILE: RES0402_0-5; Chkd/date: VASANTHA/201216; Crtd /date: MUDDU/190810; Datasheet: Y:\MIS_DATABASE\DATASHEETS\RESISTORS\CRCW0603.PDF; Temperature: -55癈+155癈; Weight: 0.65mg; Height: 0.40MM; Distributor_part_number: 541-0.0JCT-ND; Distributor_name: DIGIKEY; Package: 0402; Wattage: 1/16W; Tolerance: NA; PCB Footprint: RES0402_0-5
R336 = RESISTOR_Dup6: RES 220E 1/10W 5% 0402; Mistral Part No: 110009030506-R; Mfr_name: PANASONIC-ECG; Mfr_part_number: ERJ-2GEJ221X; Part_type: RESISTORS\FIXED; Project: RED EYE; Customs_HS_Code: 85332119; Custom_Duty: 15%; Voltage: NA; Footprint Ref: RES0402_0-5; Tolerance: 5%; Wattage: 1/10W; Package: 0402; Distributor_name: DIGIKEY; Distributor_part_number: P220JCT-ND; Height: 0.40MM; Datasheet: Y:\MIS_DATABASE\DATASHEETS\RESISTORS\PAN-ERJSER_NOV17.PDF; Crtd /date: GEETHA/260406; Chkd/date: VASANTHA/291216; Library Ref: RESISTOR; Weight: 0.8mg; Temperature: -55癈+155癈; MECHANICAL 3D STEP FILE: RES0402_0-5; Library Path: Y:\MIS_DATABASE\Library\ALTIUM_TOOL\SCHEMATICS_PARTS\MS_DISCRETE_Library.schlib; Footprint Path: Y:\MIS_DATABASE\Library\ALTIUM_TOOL\PCB_FOOTPRINTS\Altium_Footprint_Lib.PcbLib; PCB Footprint: RES0402_0-5
R612 R613 = RESISTOR_Dup6: RES 220E 1/10W 5% 0402; Part_type: RESISTORS\FIXED; Mfr_part_number: ERJ-2GEJ221X; Mfr_name: PANASONIC-ECG; Mistral Part No: 110009030506-R; Custom_Duty: 15%; Customs_HS_Code: 85332119; Project: RED EYE; Voltage: NA; Chkd/date: VASANTHA/291216; Crtd /date: GEETHA/260406; Datasheet: Y:\MIS_DATABASE\DATASHEETS\RESISTORS\PAN-ERJSER_NOV17.PDF; Height: 0.40MM; Distributor_part_number: P220JCT-ND; Distributor_name: DIGIKEY; Package: 0402; Wattage: 1/10W; Tolerance: 5%; Library Ref: RESISTOR; Weight: 0.8mg; Temperature: -55癈+155癈; MECHANICAL 3D STEP FILE: RES0402_0-5; Library Path: Y:\MIS_DATABASE\Library\ALTIUM_TOOL\SCHEMATICS_PARTS\MS_DISCRETE_Library.schlib; Footprint Path: Y:\MIS_DATABASE\Library\ALTIUM_TOOL\PCB_FOOTPRINTS\Altium_Footprint_Lib.PcbLib; Footprint Ref: RES0402_0-5; PCB Footprint: RES0402_0-5
TP17 = TESTPOINT: TESTPOINT CIR 20 SMD; Mfr_name: LOCAL; MECHANICAL 3D STEP FILE: NA; Project: BT MODULE_CSRBC04; RoHS: NA; Footprint Ref: TP20_SMD; Library Ref: TESTPOINT; Footprint Path: Y:\MIS_DATABASE\Library\ALTIUM_TOOL\PCB_FOOTPRINTS\Altium_Footprint_Lib.PcbLib; Library Path: Y:\MIS_DATABASE\Library\ALTIUM_TOOL\SCHEMATICS_PARTS\MS_DISCRETE_Library.schlib; Datasheet: NA; Temperature: NA; Weight: NA; Wattage: NA; Voltage: NA; Tolerance: NA; Mistral Part No: NA; Mfr_part_number: TP20_SMD; Part_type: TESTPOINT; Package: SMD; Distributor_name: NA; Distributor_part_number: NA; Height: NA; Crtd /date: MAZHAR/171006; Chkd/date: SHREESHAIL/171006; Customs_HS_Code: NA; Custom_Duty: NA; PCB Footprint: TP20_SMD
TP19 = TESTPOINT: TESTPOINT CIR 20 SMD; Mistral Part No: NA; Mfr_name: LOCAL; Project: BT MODULE_CSRBC04; RoHS: NA; Footprint Ref: TP20_SMD; Library Ref: TESTPOINT; Mfr_part_number: TP20_SMD; Part_type: TESTPOINT; Package: SMD; Distributor_name: NA; Distributor_part_number: NA; Height: NA; Crtd /date: MAZHAR/171006; Chkd/date: SHREESHAIL/171006; Tolerance: NA; Voltage: NA; Wattage: NA; Weight: NA; Temperature: NA; Datasheet: NA; MECHANICAL 3D STEP FILE: NA; Library Path: Y:\MIS_DATABASE\Library\ALTIUM_TOOL\SCHEMATICS_PARTS\MS_DISCRETE_Library.schlib; Footprint Path: Y:\MIS_DATABASE\Library\ALTIUM_TOOL\PCB_FOOTPRINTS\Altium_Footprint_Lib.PcbLib; Customs_HS_Code: NA; Custom_Duty: NA; PCB Footprint: TP20_SMD
U19 = SN74LVC1G08DBVRE4_SOT23-5: IC SINGLE 2-INPUT POSITIVE AND GATE SOT23-5; Part_type: ICS\DIGITAL\GATES; Mfr_name: TEXAS INSTRUMENTS; Mistral Part No: 141009060026-R; Custom_Duty: 15%; Customs_HS_Code: 85423100; Project: KHAN_MAIN; PCB Footprint: SOT23-5; RoHS: Sb/ Br FREE; Chkd/date: SUHAS/221010; Crtd /date: USMAN/151008; Datasheet: Y:\MIS_DATABASE\DATASHEETS\ICS\DIGITAL\GATES\SN74LVC1G08.PDF; Temperature: -40癈+85癈; Height: 1.45MM; Library Ref: SN74LVC1G08DBVRE4_SOT23-5; Distributor_part_number: SN74LVC1G08DBVRE4-ND; Distributor_name: DIGIKEY; Package: SOT23-5; Mfr_part_number: SN74LVC1G08DBVRE4
U20 = DP83869HM_VQFN48: IC ETHERNET TRANSCEIVER 10/100/1000 WITH COPPER AND FIBRE INTERFACE VQFN48; Mistral Part No: 143019050002-R; Mfr_name: TEXAS INSTRUMENTS; Part_type: ICS\TELECOM\TRANSCEIVER; Project: J7ES_ENET_DP83869HM_EXP; Tolerance: NA; Customs_HS_Code: 85423100; Custom_Duty: 15%; Footprint Ref: QFN48_19-68_280X280_1_EP4-2; Mfr_part_number: DP83869HMRGZT; Voltage: NA; Wattage: NA; Package: VQFN48; Distributor_name: DIGIKEY; Distributor_part_number: 296-53377-1-ND; Library Ref: DP83869HM_VQFN48; Height: 1.00MM; Weight: NA; Temperature: -40癈+125癈; Datasheet: Y:\MIS_DATABASE\DATASHEETS\ICS\TELECOM\DP83869HM.PDF; Crtd /date: ALVY/060519; Chkd/date: MANIRAJA/060519; MECHANICAL 3D STEP FILE: QFN48_19-68_280X280_1_EP4-2; Library Path: Y:\MIS_DATABASE\Library\ALTIUM_TOOL\SCHEMATICS_PARTS\MS_TELECOM_Library.schlib; Footprint Path: Y:\MIS_DATABASE\Library\ALTIUM_TOOL\PCB_FOOTPRINTS\Altium_Footprint_Lib.PcbLib; PCB Footprint: QFN48_19-68_280X280_1_EP4-2